# EAGLE design u-nex_SHIELD_SHIELD (EAGLE 6.5.0)
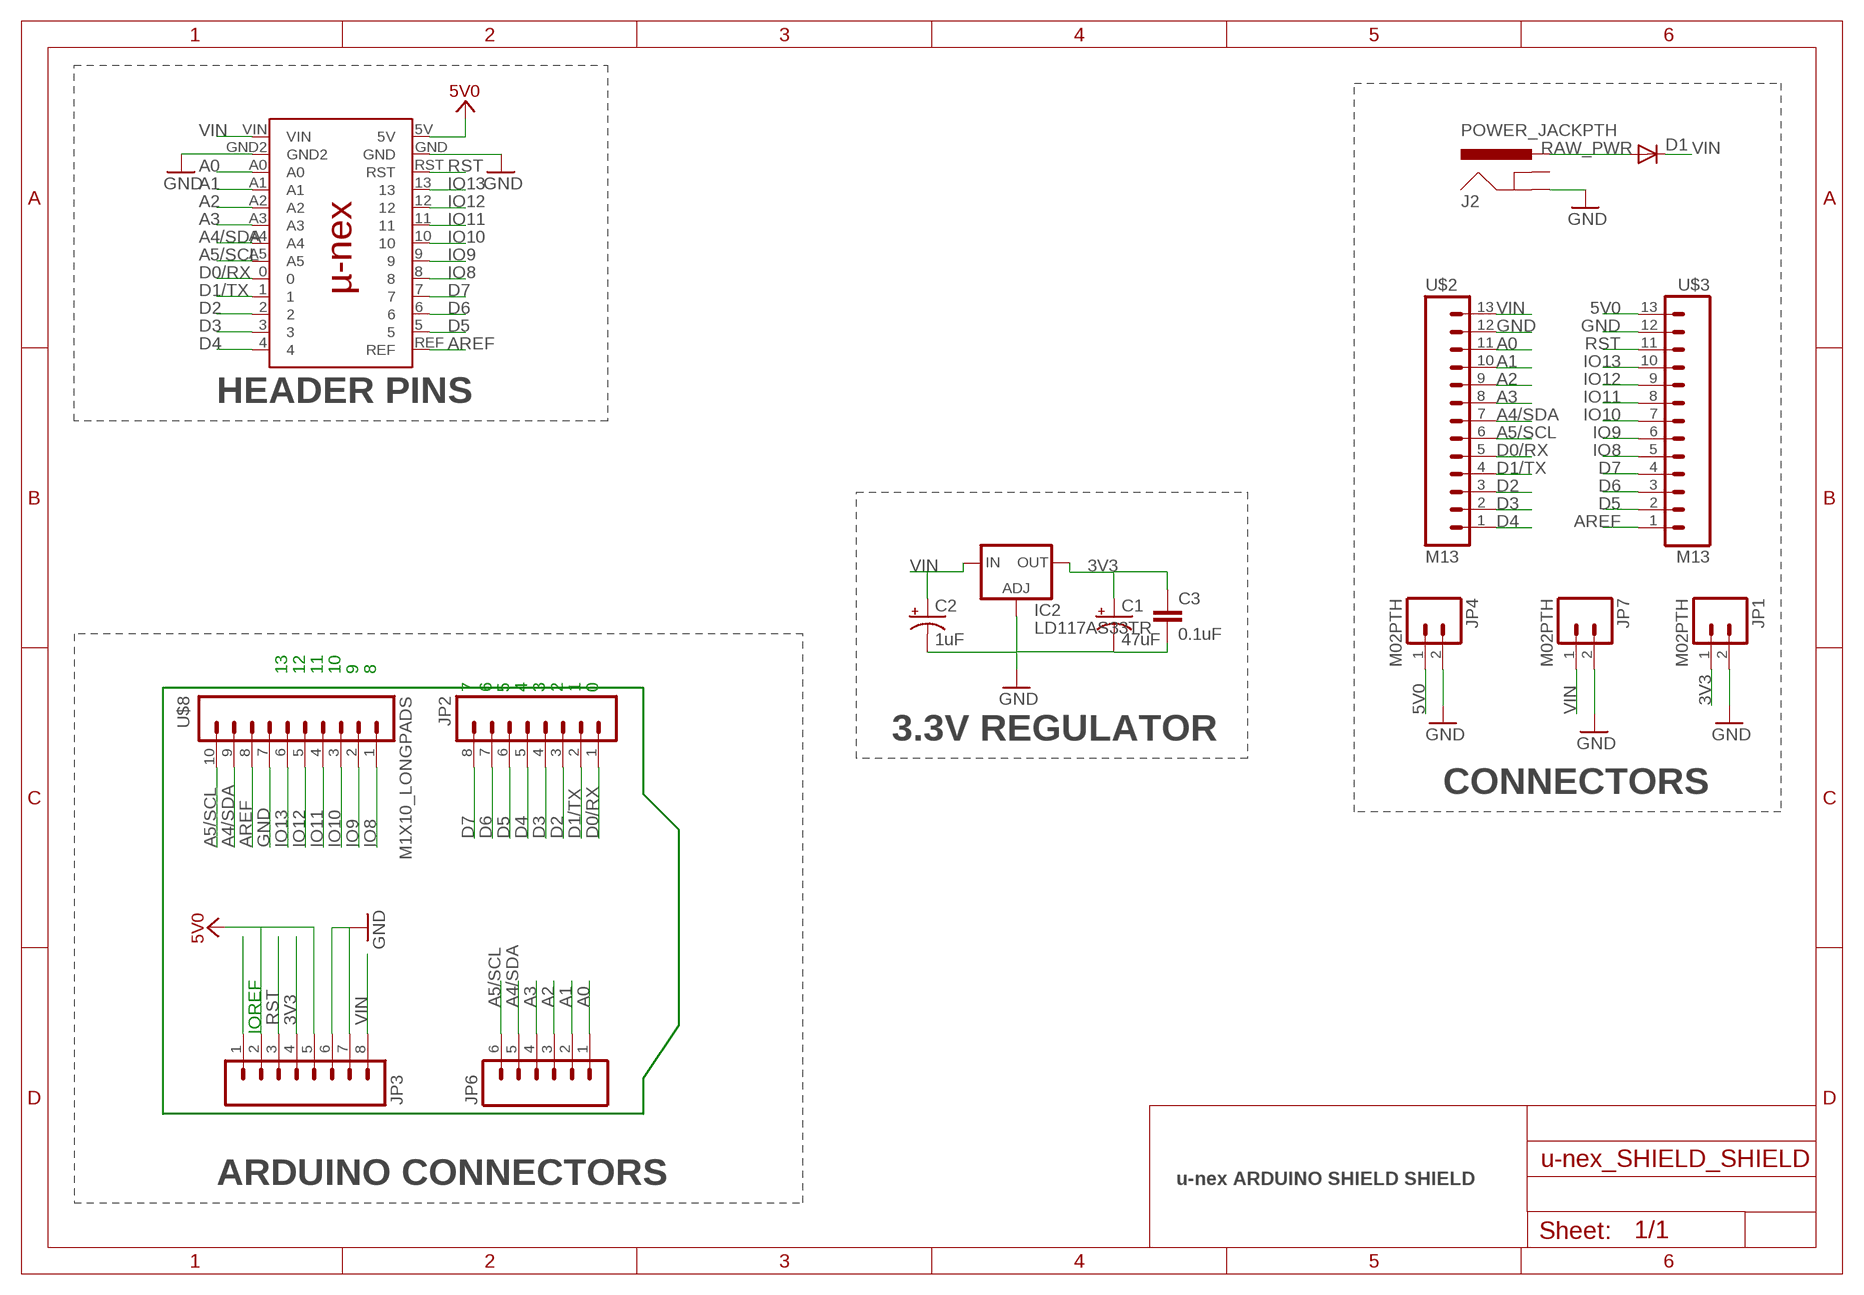
[diagram p0: schematic, sheet 1]

## Parts
C1  47uF  CAP_POLPTH1  [CPOL-RADIAL-100UF-25V]
C2  1uF  CAP_POLPTH1  [CPOL-RADIAL-100UF-25V]
C3  0.1uF  CAPEZ  [CAP-PTH-SMALLEZ]
D1  DIODEPTH  [DIODE-1N4001]
IC2  LD117AS33TR  [SOT223]
J2  POWER_JACKPTH  [POWER_JACK_PTH]
JP1  M02PTH  [1X02]
JP2  M08LONGPADS  [1X08_LONGPADS]
JP3  M08LONGPADS  [1X08_LONGPADS]
JP4  M02PTH  [1X02]
JP6  M06LONGPADS  [1X06_LONGPADS]
JP7  M02PTH  [1X02]
U$2  M13  [1X13]
U$3  M13  [1X13]
U$8  M1X10_LONGPADS  [1X10_LONGPADS]
U$10  U-NEX  [U-NEX]

## Nets
3V3: C1.1(+) C3.1 IC2.4(OUT) JP1.1 JP3.4
5V0: JP3.2 JP3.5 JP4.1 U$3.13 U$10.5V
A0: JP6.1 U$2.11 U$10.A0
A1: JP6.2 U$2.10 U$10.A1
A2: JP6.3 U$2.9 U$10.A2
A3: JP6.4 U$2.8 U$10.A3
A4/SDA: JP6.5 U$2.7 U$8.9 U$10.A4
A5/SCL: JP6.6 U$2.6 U$8.10 U$10.A5
AREF [aref]: U$3.1 U$8.8 U$10.REF
D0/RX: JP2.1 U$2.5 U$10.0
D1/TX: JP2.2 U$2.4 U$10.1
D2: JP2.3 U$2.3 U$10.2
D3: JP2.4 U$2.2 U$10.3
D4: JP2.5 U$2.1 U$10.4
D5: JP2.6 U$3.2 U$10.5
D6: JP2.7 U$3.3 U$10.6
D7: JP2.8 U$3.4 U$10.7
GND: C1.2(-) C2.2(-) C3.2 IC2.1(ADJ) J2.GND JP1.2 JP3.6 JP3.7 JP4.2 JP7.2 U$2.12 U$3.12 U$8.7 U$10.GND U$10.GND2
IO8: U$3.5 U$8.1 U$10.8
IO9: U$3.6 U$8.2 U$10.9
IO10: U$3.7 U$8.3 U$10.10
IO11: U$3.8 U$8.4 U$10.11
IO12: U$3.9 U$8.5 U$10.12
IO13: U$3.10 U$8.6 U$10.13
N$2: JP3.1
RAW_PWR: D1.A J2.PWR
RST: JP3.3 U$3.11 U$10.RST
VIN: C2.1(+) D1.C IC2.3(IN) JP3.8 JP7.1 U$2.13 U$10.VIN
Unconnected: J2.GNDBREAK

## Notes on the sheet
- HEADER PINS
- 13 | 12 | 11 | 10 | 9 | 8
- 7 | 6 | 5 | 4 | 3 | 2 | 1 | 0
- 3.3V REGULATOR
- CONNECTORS
- IOREF
- ARDUINO CONNECTORS | u-nex ARDUINO SHIELD SHIELD

## Library data of the parts
C1 C2 = SparkFun-Capacitors:CAP_POL: Capacitor Polarized These are standard SMD and PTH capacitors. Normally 10uF, 47uF, and 100uF in electrolytic and tantalum varieties. Always verify the external diameter of the through hole cap, it varies with capacity, voltage, and manufacturer. The EIA devices should be standard.
C3 = SparkFun-Capacitors:CAP: Capacitor Standard 0603 ceramic capacitor, and 0.1" leaded capacitor.
D1 = SparkFun-DiscreteSemi:DIODE: Diode These are standard reverse protection diodes and small signal diodes. SMA package can handle up to about 1A. SOD-323 can handle about 200mA. What the SOD-323 package when ordering, there are some mfgs out there that are 5-pin packages.
IC2 = v-reg:LD117A?*: Low drop fixed and adjustable positive voltage regulators 1 A Source: http://www.st.com/stonline/products/literature/ds/7194/ld1117axx.pdf
J2 = SparkFun-Connectors:POWER_JACK: Power Jack This is the standard 5.5mm barrel jack for power. The PTH is the most common, proven, reliable, footprint. The Slot footprint only works if the mill layer is transmitted to the PCB fab house so be warned. Spark Fun Electronics SKU : PRT-00119 SMT: CONN-08106 Mating wall wart : TOL-00298 (and others)
JP1 JP4 JP7 = SparkFun-Connectors:M02: Standard 2-pin 0.1" header. Use with - straight break away headers ( PRT-00116) - right angle break away headers (PRT-00553) - swiss pins (PRT-00743) - machine pins (PRT-00117) - female headers (PRT-00115) Molex polarized connector foot print use with: PRT-08233 with associated crimp pins and housings. 2.54_SCREWTERM for use with PRT-10571. 3.5mm Screw Terminal footprints for PRT-08084 5mm Screw Terminal footprints for use with PRT-08433
JP2 JP3 = SparkFun-Connectors:M08: Header 8 Standard 8-pin 0.1" header. Use with straight break away headers (SKU : PRT-00116), right angle break away headers (PRT-00553), swiss pins (PRT-00743), machine pins (PRT-00117), and female headers (PRT-00115).
JP6 = SparkFun-Connectors:M06: Header 6 Standard 6-pin 0.1" header. Use with straight break away headers (SKU : PRT-00116), right angle break away headers (PRT-00553), swiss pins (PRT-00743), machine pins (PRT-00117), and female headers (PRT-00115). Molex polarized connector foot print use with SKU : PRT-08094 with associated crimp pins and housings. NOTES ON THE VARIANTS LOCK and LOCK_LONGPADS... This footprint was designed to help hold the alignment of a through-hole component (i.e. 6-pin header) while soldering it into place. You may notice that each hole has been shifted either up or down by 0.005 of an inch from it's more standard position (which is a perfectly straight line). This slight alteration caused the pins (the squares in the middle) to touch the edges of the holes. Because they are alternating, it causes a "brace" to hold the component in place. 0.005 has proven to be the perfect amount of "off-center" position when using our standard breakaway headers. Although looks a little odd when you look at the bare footprint, once you have a header in there, the alteration is very hard to notice. Also,if you push a header all the way into place, it is covered up entirely on the bottom side. This idea of altering the position of holes to aid alignment will be further integrated into the Sparkfun Library for other footprints. It can help hold any component with 3 or more connection pins.
U$2 U$3 = Frenoy_custom_GOA:M13
U$8 = Frenoy_Custom:M1X10_LONGPADS
U$10 = Frenoy_Custom:U-NEX

## Net classes
1 power: width 0.254 mm, drill 0.61 mm, clearance 0.254 mm
2 gnd: width 0.254 mm, drill 0.61 mm, clearance 0.254 mm
3 usbvcc: width 0.254 mm, drill 0.61 mm, clearance 0.254 mm
4 aref: width 0.254 mm, drill 0.61 mm, clearance 0.254 mm

## Board
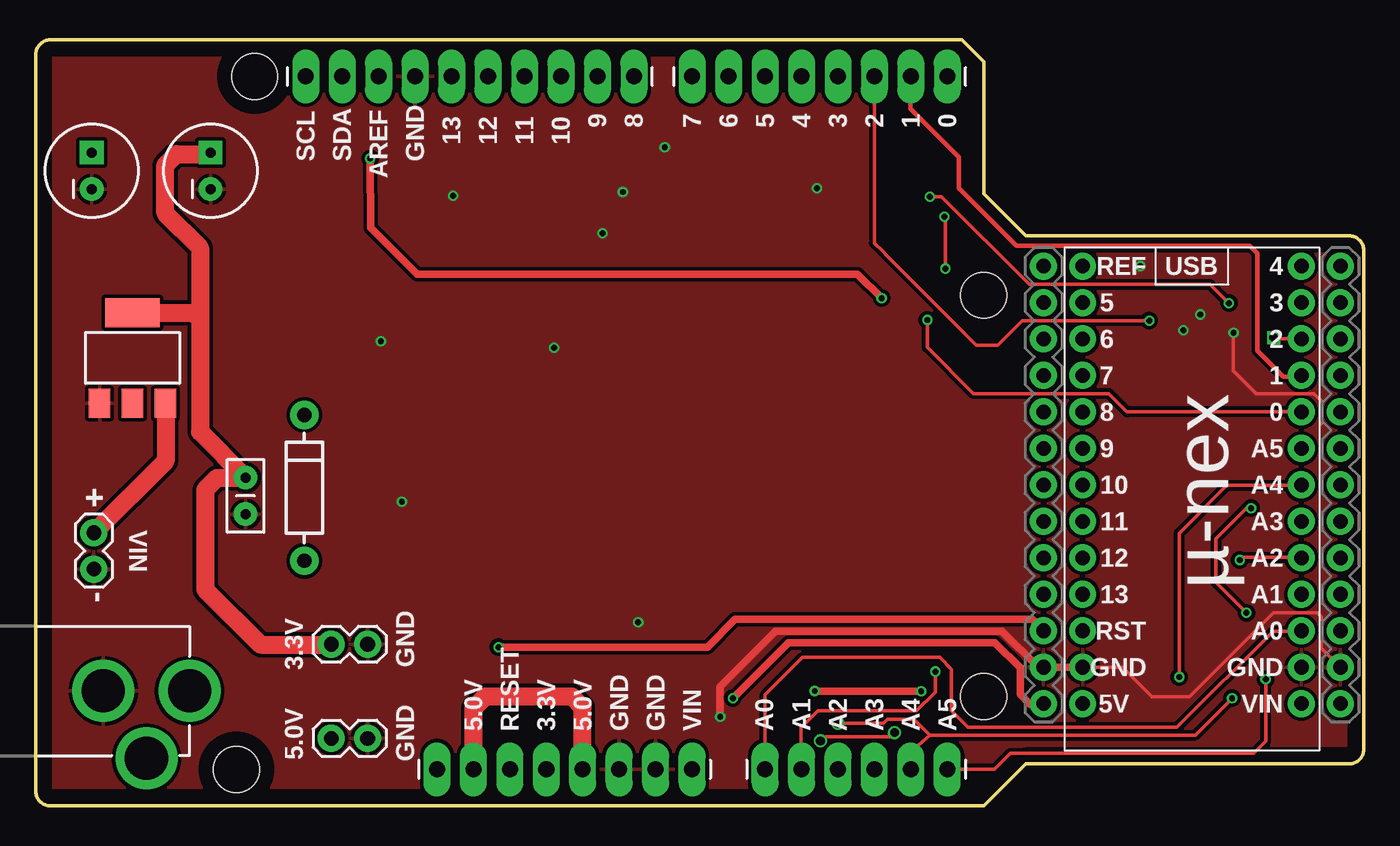
[diagram p1: board, top side]
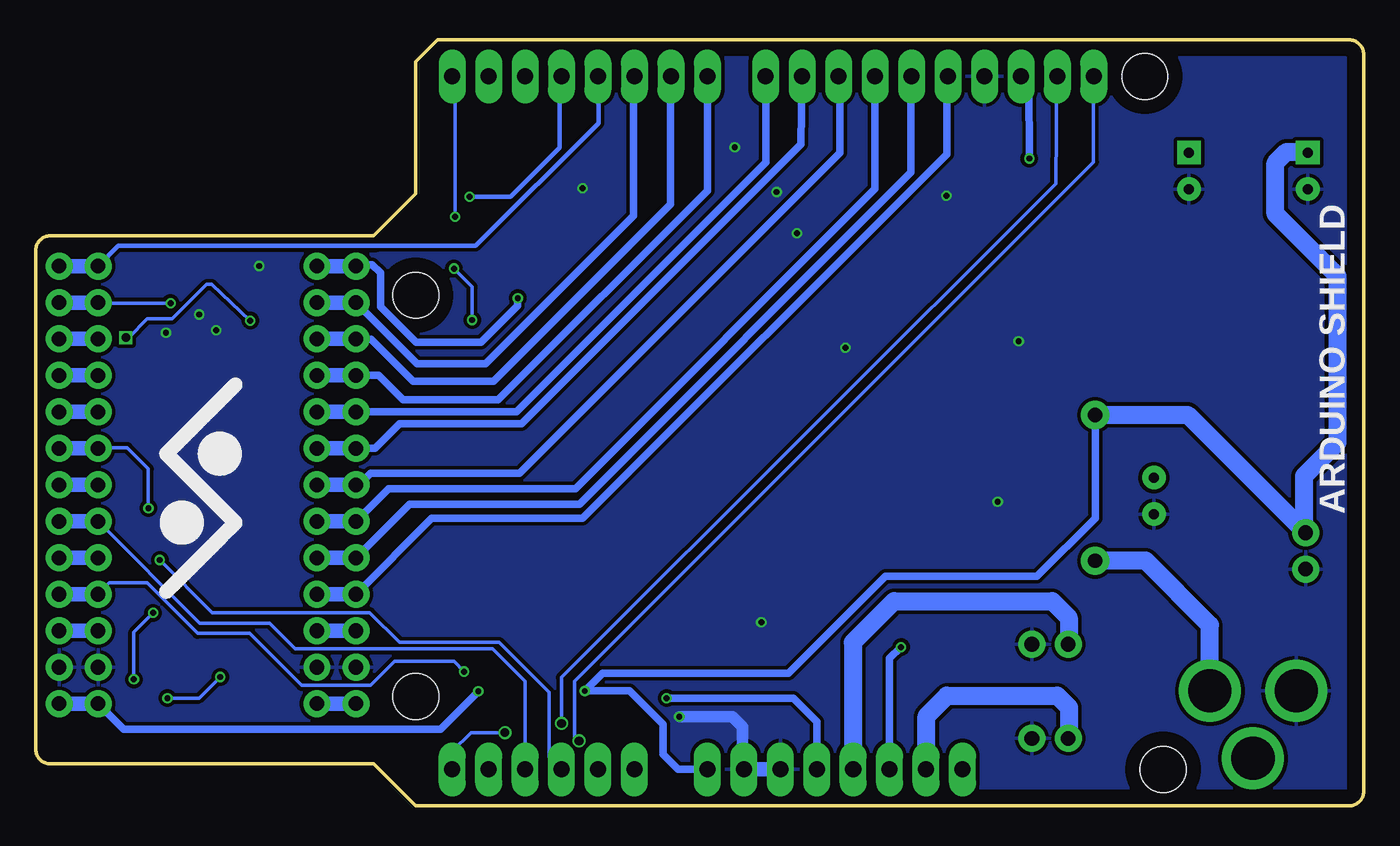
[diagram p2: board, bottom side, seen from below]

Size 92.5 x 53.34 mm. Coordinates in mm from the lower left corner, seen from the top.
Outline: 64.52,53.34 66.04,51.82 66.04,42.62 68.96,39.7 91.5,39.7 arc-90 92.5,38.7 92.5,3.92 arc-90 91.5,2.92 68.96,2.92 66.04,0 1,0 arc-90 0,1 0,52.34 arc-90 1,53.34 64.52,53.34
Copper layers (1*16): Top 0.035mm / dielectric 1.5mm / Bottom 0.035mm
Design rules "default": minimum track width 10mil, minimum drill 16mil, track to track 8mil, track to pad 8mil, pad to pad 8mil, via to via 8mil, smd to smd 8mil, copper to edge 40mil, drill to drill 8mil, minimum pad ring 10mil, minimum via ring 6mil, stop-mask expansion 4mil, vias tented up to drill 16mil, thermal gap 10mil
Holes 3.2 mm at 15.24,50.8 66.04,35.56 66.04,7.62 13.97,2.54

### Footprints (pad centres in the part's own frame; a part is rotated, then mirrored left to right if it is on the bottom)
CPOL-RADIAL-100UF-25V = drill 0.7 pad 1.651 square: 1 1.27,0 | drill 0.7 pad 1.651: 2 -1.27,0
CAP-PTH-SMALLEZ = drill 0.7 pad 1.651: 1 0,0; 2 2.54,0
DIODE-1N4001 = drill 1 pad 1.981: A -5.08,0; C 5.08,0
SOT223 = smd 1.5 x 2: 1 -2.3,-3.15; 2 0,-3.15; 3 2.3,-3.15 | smd 3.8 x 2: 4 0,3.15
POWER_JACK_PTH = drill 2.997 pad 4.318: GND 0,7.7; GNDBREAK 4.7,10.7; PWR 0,13.7
1X02 = drill 1.016 pad 1.88: 1 0,0; 2 2.54,0
1X08_LONGPADS = drill 1.118 pad 1.88 long: 1 0,0; 2 2.54,0; 3 5.08,0; 4 7.62,0; 5 10.16,0; 6 12.7,0; 7 15.24,0; 8 17.78,0
1X06_LONGPADS = drill 1.118 pad 1.88 long: 1 0,0; 2 2.54,0; 3 5.08,0; 4 7.62,0; 5 10.16,0; 6 12.7,0
1X13 = drill 1.016 pad 1.88: 1 0,0; 2 2.54,0; 3 5.08,0; 4 7.62,0; 5 10.16,0; 6 12.7,0; 7 15.24,0; 8 17.78,0; 9 20.32,0; 10 22.86,0; 11 25.4,0; 12 27.94,0; 13 30.48,0
1X10_LONGPADS = drill 1.118 pad 1.88 long: 1 0,0; 2 2.54,0; 3 5.08,0; 4 7.62,0; 5 10.16,0; 6 12.7,0; 7 15.24,0; 8 17.78,0; 9 20.32,0; 10 22.86,0
U-NEX = drill 1.016 pad 1.88: 0 1.27,11.43; 1 1.27,8.89; 2 1.27,6.35; 3 1.27,3.81; 4 1.27,1.27; 5 16.51,3.81; 5V 16.51,31.75; 6 16.51,6.35; 7 16.51,8.89; 8 16.51,11.43; 9 16.51,13.97; 10 16.51,16.51; 11 16.51,19.05; 12 16.51,21.59; 13 16.51,24.13; A0 1.27,26.67; A1 1.27,24.13; A2 1.27,21.59; A3 1.27,19.05; A4 1.27,16.51; A5 1.27,13.97; GND 16.51,29.21; GND2 1.27,29.21; REF 16.51,1.27; RST 16.51,26.67; VIN 1.27,31.75

### Placement (x,y rotation side)
C1  12.17,44.22 90 top
C2  3.89,44.22 90 top
C3  14.61,22.86 270 top
D1  18.7,22.15 90 top
IC2  6.74,31.19 0 top
J2  -3,8 270 top
JP1  20.57,11.25 0 top
JP2  63.5,50.8 180 top
JP3  27.94,2.54 0 top
JP4  20.57,4.7 0 top
JP6  50.8,2.54 0 top
JP7  4.04,19.02 270 top
U$2  90.88,37.59 270 top
U$3  70.21,37.59 270 top
U$8  41.66,50.8 180 top
U$10  89.43,38.86 180 top

### Tracks (layer width: path | path; a pad name or v marks a point on that pad's centre or on a via)
3V3
  Top 1.27: JP1.1 20.55,11.23 15.65,11.23 11.81,15.06 11.81,22.02 12.62,22.84 14.58,22.84 C3.1 11.43,26.04 11.43,33.88 | C1.1 12.06,45.39 9.78,45.39 9.02,44.63 9.02,41.27 11.43,38.86 11.43,33.88 | IC2.4 10.97,34.34 11.43,33.88
  Bottom 1.27: JP1.1 20.55,11.28 20.55,13.11 21.69,14.25 32.72,14.25 35.59,11.38 35.59,2.56 JP3.4
5V0  (via drill 0.41)
  Top 0.508: v48.56,7.49 52.43,11.35 66.83,11.35 68.58,9.6 68.58,7.77 69.27,7.09 70.18,7.09 U$3.13
  Top 1.27: JP3.5 38.1,6.86 37.34,7.62 31.32,7.62 30.48,6.78 JP3.2
  Bottom 0.254: 38.23,2.67 JP3.5
  Bottom 0.508: v48.56,7.49 39.73,7.49 38.1,5.87 JP3.5
  Bottom 1.016: U$10.5V U$3.13
  Bottom 1.143: 30.45,2.56 JP3.2
  Bottom 1.27: 30.45,2.56 30.45,6.25 29.03,7.67 21.34,7.67 20.52,6.86 20.52,4.75 JP4.1
A0
  Top 0.254: JP6.1 50.8,7.72 53.42,10.34 62.97,10.34 63.78,9.53 63.78,6.6 64.92,5.46 79.5,5.46 86.21,12.17 88.14,12.17 U$10.A0
  Bottom 1.016: U$10.A0 U$2.11
A1  (via drill 0.41 pad 0.71)
  Top 0.254: JP6.2 53.31,2.56 53.31,5.44 54.48,6.6 61.34,6.6 62.66,7.92 v62.66,9.35
  Bottom 0.254: U$10.A1 87.38,15.52 84.73,15.52 81.23,12.01 77.62,12.01 73.99,8.38 69.19,8.38 67.51,10.06 63.37,10.06 v62.66,9.35
  Bottom 1.016: U$10.A1 U$2.10
A2  (via drill 0.41)
  Top 0.254: U$10.A2 88.14,17.3 84.05,17.3 v83.87,17.12
  Bottom 0.254: v83.87,17.12 80.21,13.46 69.24,13.46 67.16,11.38 60.22,11.38 56.74,7.9 56.74,3.4 JP6.3
  Bottom 1.016: U$10.A2 U$2.9
A3
  Bottom 0.254: U$10.A3 81.08,12.72 76.2,12.72 74.45,10.92 60.68,10.92 58.42,8.66 JP6.4
  Bottom 1.016: U$10.A3 U$2.8
A4/SDA  (via drill 0.41 pad 0.71, 0.6)
  Top 0.254: 62.28,4.93 60.96,3.76 JP6.5 | 62.28,4.93 80.77,4.93 v83.34,7.49 | v79.65,8.97 79.65,19 82.98,22.33 88.14,22.33 | v55.88,5.74 59.03,5.74 59.33,6.04 61.16,6.04 62.28,4.93
  Top 1.016: 88.14,22.33 88.16,22.33 U$10.A4
  Bottom 0.254: v83.34,7.49 81.13,7.49 v79.65,8.97 | U$8.9 21.36,50.77 21.44,43.33 55.63,9.2 55.88,8.94 v55.88,5.74
  Bottom 1.016: U$2.7 U$10.A4
A5/SCL  (via drill 0.41 pad 0.71, 0.6)
  Top 0.254: v84.66,20.73 84.33,20.73 82.19,18.59 82.19,15.57 v84.33,13.44 | v85.67,8.81 85.67,4.5 84.84,3.66 67.89,3.66 66.78,2.54 JP6.6 | v54.66,4.52 54.69,4.52 54.99,4.83 59.54,4.83 v59.82,5.11
  Bottom 0.254: v84.66,20.73 84.66,23.47 86.13,24.94 88.11,24.94 | v85.67,8.81 85.67,12.09 v84.33,13.44 | v54.66,4.52 54.97,4.83 54.97,8.69 18.82,44.83 18.82,50.77 U$8.10 | v59.82,5.11 62.18,5.11 63.5,3.79 JP6.6
  Bottom 1.016: U$2.6 U$10.A5 88.16,24.94 88.11,24.94
AREF  (via drill 0.41, 0.41 pad 0.71)
  Top 0.508: v23.29,45.09 23.32,40.26 26.54,37.03 57.25,37.03 v58.93,35.36
  Bottom 0.508: v58.93,35.36 58.93,34.82 61.47,32.28 66.02,32.28 68.48,34.75 68.48,37.11 69.06,37.69 70.1,37.69 U$3.1 | v23.29,45.09 23.32,50.24 U$8.8
  Bottom 1.016: U$3.1 U$10.REF
D0/RX  (via drill 0.41, 0.41 pad 0.71)
  Top 0.254: U$10.0 76.02,27.43 74.75,28.7 65.33,28.7 62.1,31.93 v62.1,33.83 | v63.37,37.41 63.37,40.95 v63.3,41.02
  Bottom 0.254: v63.3,41.02 63.3,50.6 JP2.1 | v62.1,33.83 62.1,36.14 v63.37,37.41
  Bottom 1.016: U$10.0 U$2.5
D1/TX
  Top 0.305: U$10.1 88.09,29.9 86.89,29.9 85.09,31.7 85.09,38.48 84.58,38.99 68.33,38.99 64.31,43 64.31,45.16 60.94,48.54 60.94,50.77 JP2.2
  Bottom 1.016: U$10.1 U$2.4
D2  (via drill 0.41 pad 0.71, 0.6)
  Top 0.254: U$10.2 86.33,32.51 v86.23,32.61 | v77.57,33.78 68.73,33.78 67.03,32.08 65.53,32.08 59.27,38.34 59,38.61 58.42,39.19 JP2.3
  Bottom 0.254: v86.23,32.61 86.03,32.61 84.73,33.91 83.01,33.91 80.59,36.32 80.24,36.32 v77.57,33.78
  Bottom 1.016: U$2.3 U$10.2
D3  (via drill 0.41 pad 0.71)
  Top 0.254: v62.28,42.42 63.09,42.42 69.22,36.32 81.79,36.32 v83.11,35
  Bottom 0.254: v83.11,35 88.11,35
  Bottom 0.305: JP2.4 56.03,50.65 56.03,45.82 59.44,42.42 v62.28,42.42
  Bottom 1.016: U$2.2 U$10.3 88.11,35.05 88.11,35
D4
  Bottom 0.305: JP2.5 53.31,50.77 53.31,47.52 61.87,38.99 86.77,38.99 U$10.4
  Bottom 1.016: U$10.4 U$2.1
D5
  Bottom 0.406: 50.75,50.75 JP2.6
  Bottom 0.508: JP2.6 50.85,50.75 50.85,41.1 61.16,30.79 65.94,30.79 U$3.2
  Bottom 1.016: U$3.2 U$10.5
D6
  Bottom 0.508: JP2.7 48.28,50.77 48.28,41.91 60.63,29.57 66.22,29.57 69.14,32.49 70.18,32.49 U$3.3
  Bottom 1.016: U$3.3 U$10.6
D7
  Bottom 0.508: 45.74,50.77 JP2.8 45.72,42.85 60.3,28.27 66.9,28.27 68.61,29.97 U$3.4
  Bottom 1.016: U$3.4 U$10.7
GND  (via drill 0.41, 0.41 pad 0.41)
  Top 0.254: U$2.12 89.56,10.97 89.56,13.18 89.28,13.46 86.21,13.46 80.34,7.59 77.75,7.59 75.69,9.65 U$10.GND | v83.44,32.94 83.44,30.3 85.04,28.7 89.03,28.7 89.53,28.19 89.53,26.62
  Top 0.508: U$8.7 26.42,50.77 | U$10.GND U$3.12 69.83,9.65 67.31,12.17 51.54,12.17 47.68,8.31 v47.68,6.2
  Bottom 0.254: 42.8,2.92 JP3.7
  Bottom 0.813: v47.68,6.2 43.97,6.2 43.28,5.51 43.28,2.64 JP3.7
  Bottom 1.016: JP3.6 JP3.7
  other vias: 76.94,37.59 79.93,33.12 81.13,34.21 40.89,42.75 43.81,45.87 54.41,43 29.06,42.49 24.03,32.36 36.09,31.9 25.5,21.18 41.96,12.78 39.47,39.88
  pour Top (isolate 0.254): -0.64,53.34 94.31,53.52 94.95,-0.46 0,-0.64
  pour Bottom (isolate 0.254): 0,53.24 93.08,53.24 93.08,-0.64 0,-0.64
IO8
  Bottom 0.508: U$8.1 41.63,50.77 41.63,44.81 59,27.43 U$3.5
  Bottom 1.016: U$3.5 U$10.8
IO9
  Bottom 0.508: U$3.6 68.86,24.89 67.16,26.59 58.65,26.59 39.19,46.08 39.14,50.67 U$8.2
  Bottom 1.016: U$3.6 U$10.9
IO10
  Bottom 0.508: U$3.7 69.75,22.35 | U$8.3 36.5,50.72 36.5,45.47 58.8,23.16 69.19,23.16 70.46,21.89 70.46,22.07 70.74,22.35
  Bottom 1.016: U$3.7 70.74,22.35 U$10.10
IO11
  Bottom 0.508: 34.01,50.77 U$8.4 34.04,42.98 54.91,22.1 67.92,22.1 U$3.8
  Bottom 1.016: U$3.8 U$10.11
IO12
  Bottom 0.508: U$8.5 31.52,50.77 31.52,44.12 54.63,21.01 66.46,21.01 U$3.9
  Bottom 1.016: U$3.9 U$10.12
IO13
  Bottom 0.508: 28.98,50.77 U$8.6 29.03,50.72 29.03,45.39 54.41,20.02 64.92,20.02 U$3.10
  Bottom 1.016: U$3.10 U$10.13
RAW_PWR
  Bottom 1.27: J2.PWR 10.7,12.58 15.19,17.07 D1.A
RST  (via drill 0.41 pad 0.71)
  Top 0.508: U$3.11 69.42,12.98 48.72,12.98 46.79,11.05 v32.23,11.05
  Bottom 0.508: JP3.3 33.02,10.26 v32.23,11.05
  Bottom 1.016: U$10.RST U$3.11
VIN  (via drill 0.41 pad 0.71)
  Top 0.508: v54.25,8 54.28,7.98 v61.67,7.98
  Top 1.27: IC2.3 9.04,24.01 JP7.1
  Bottom 0.508: JP3.8 47.75,2.54 48.82,3.61 48.82,5.66 51.16,8 v54.25,8 53.01,9.25 40.06,9.25 33.33,15.98 22.76,15.98 18.7,20.03 D1.C | v61.67,7.98 64.31,5.33 86.39,5.33 U$10.VIN
  Bottom 1.016: U$10.VIN U$2.13
  Bottom 1.27: C2.1 3.94,45.54 5.38,45.54 6.15,44.78 6.15,41.22 1.83,36.91 1.83,25.3 4.17,22.96 4.17,19.14 JP7.1 12.25,27.23 D1.C

### Text on the board
tPlace: + | -
bPlace: ARDUINO SHIELD
tNames: 9 | 8 | 7 | 6 | 5 | 4 | 3 | 2 | 1 | 0 | 13 | 12 | 11 | 10 | SCL | SDA | GND | AREF | VIN | GND | 3.3V | 5.0V | RESET | 3.3V | 5.0V | GND | GND | VIN | A0 | A1 | A2 | A3 | A4 | A5 | 5.0V | GND